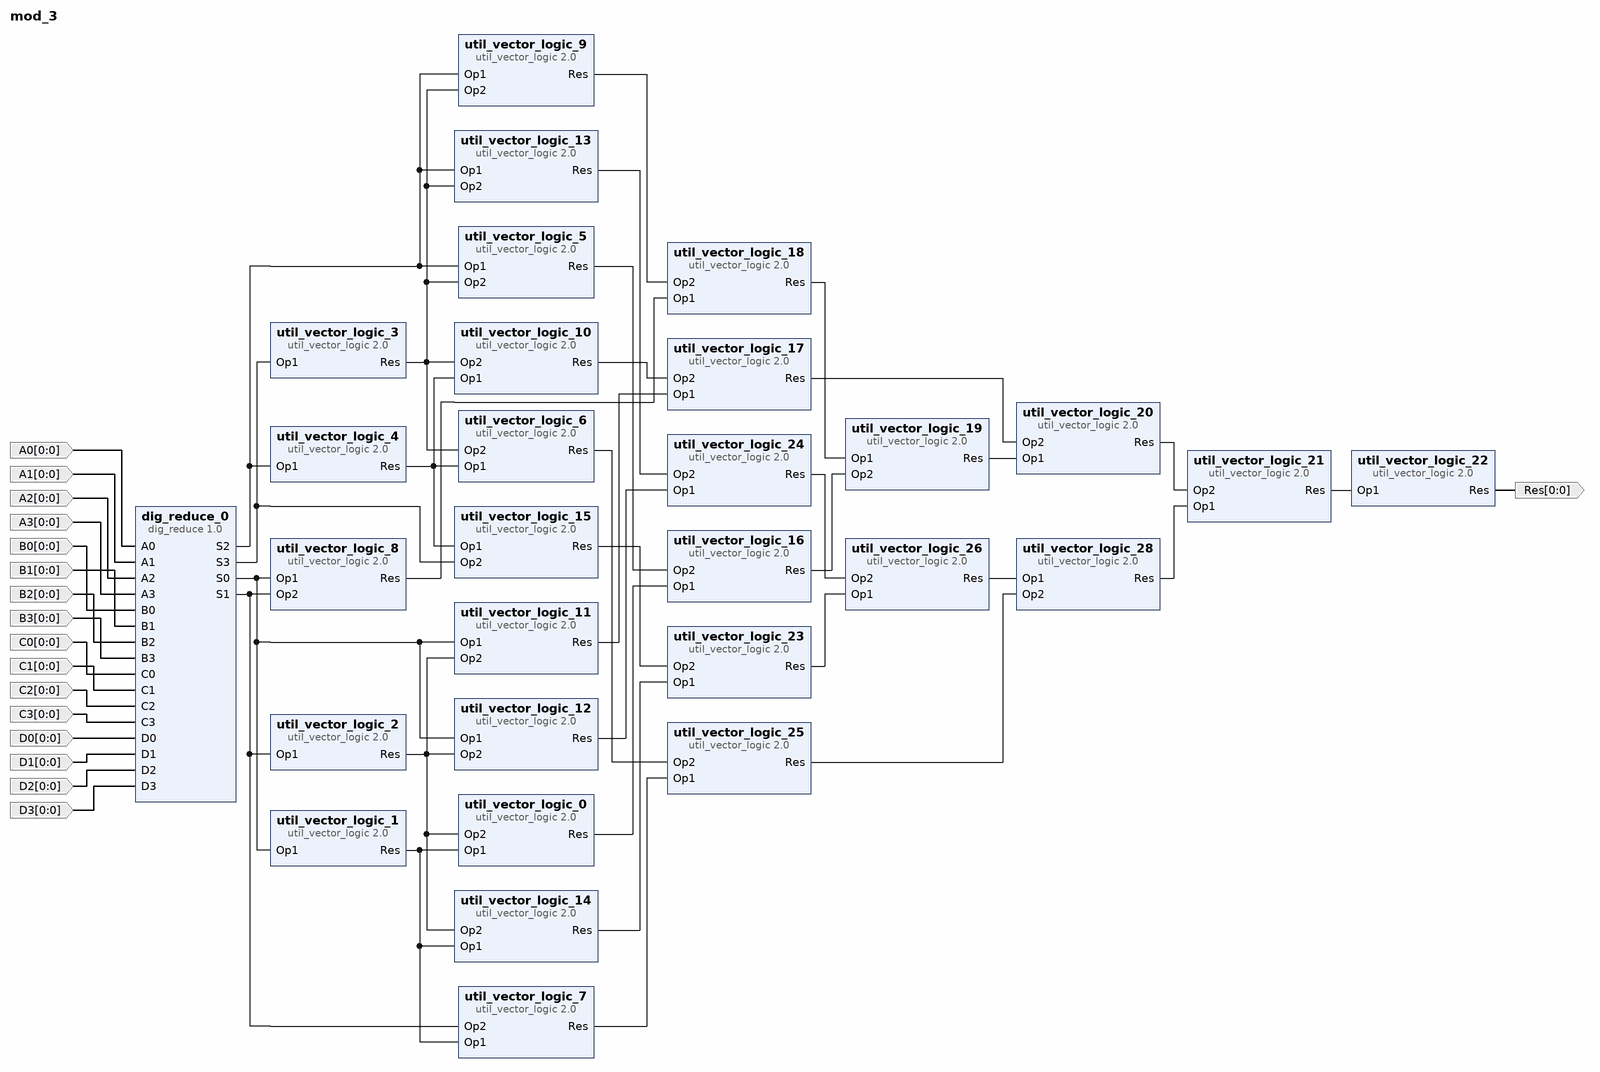
[diagram p0: block diagram of the top level]
# Vivado block design mod_3, xc7vx485tffg1157-1, Vivado 2019.1
create_bd_design mod_3

create_bd_port -dir I -from 0 -to 0 A0
create_bd_port -dir I -from 0 -to 0 A1
create_bd_port -dir I -from 0 -to 0 A2
create_bd_port -dir I -from 0 -to 0 A3
create_bd_port -dir I -from 0 -to 0 B0
create_bd_port -dir I -from 0 -to 0 B1
create_bd_port -dir I -from 0 -to 0 B2
create_bd_port -dir I -from 0 -to 0 B3
create_bd_port -dir I -from 0 -to 0 C0
create_bd_port -dir I -from 0 -to 0 C1
create_bd_port -dir I -from 0 -to 0 C2
create_bd_port -dir I -from 0 -to 0 C3
create_bd_port -dir I -from 0 -to 0 D0
create_bd_port -dir I -from 0 -to 0 D1
create_bd_port -dir I -from 0 -to 0 D2
create_bd_port -dir I -from 0 -to 0 D3
create_bd_port -dir O -from 0 -to 0 Res

create_bd_cell -type ip -vlnv Group5:user:dig_reduce:1.0 dig_reduce_0
create_bd_cell -type ip -vlnv xilinx.com:ip:util_vector_logic:2.0 util_vector_logic_0
set_property -dict {CONFIG.C_SIZE 1} [get_bd_cells util_vector_logic_0]
create_bd_cell -type ip -vlnv xilinx.com:ip:util_vector_logic:2.0 util_vector_logic_1
set_property -dict {CONFIG.C_OPERATION not CONFIG.C_SIZE 1} [get_bd_cells util_vector_logic_1]
create_bd_cell -type ip -vlnv xilinx.com:ip:util_vector_logic:2.0 util_vector_logic_2
set_property -dict {CONFIG.C_OPERATION not CONFIG.C_SIZE 1} [get_bd_cells util_vector_logic_2]
create_bd_cell -type ip -vlnv xilinx.com:ip:util_vector_logic:2.0 util_vector_logic_3
set_property -dict {CONFIG.C_OPERATION not CONFIG.C_SIZE 1} [get_bd_cells util_vector_logic_3]
create_bd_cell -type ip -vlnv xilinx.com:ip:util_vector_logic:2.0 util_vector_logic_4
set_property -dict {CONFIG.C_OPERATION not CONFIG.C_SIZE 1} [get_bd_cells util_vector_logic_4]
create_bd_cell -type ip -vlnv xilinx.com:ip:util_vector_logic:2.0 util_vector_logic_5
set_property -dict {CONFIG.C_SIZE 1} [get_bd_cells util_vector_logic_5]
create_bd_cell -type ip -vlnv xilinx.com:ip:util_vector_logic:2.0 util_vector_logic_6
set_property -dict {CONFIG.C_SIZE 1} [get_bd_cells util_vector_logic_6]
create_bd_cell -type ip -vlnv xilinx.com:ip:util_vector_logic:2.0 util_vector_logic_7
set_property -dict {CONFIG.C_SIZE 1} [get_bd_cells util_vector_logic_7]
create_bd_cell -type ip -vlnv xilinx.com:ip:util_vector_logic:2.0 util_vector_logic_8
set_property -dict {CONFIG.C_SIZE 1} [get_bd_cells util_vector_logic_8]
create_bd_cell -type ip -vlnv xilinx.com:ip:util_vector_logic:2.0 util_vector_logic_9
set_property -dict {CONFIG.C_SIZE 1} [get_bd_cells util_vector_logic_9]
create_bd_cell -type ip -vlnv xilinx.com:ip:util_vector_logic:2.0 util_vector_logic_10
set_property -dict {CONFIG.C_SIZE 1} [get_bd_cells util_vector_logic_10]
create_bd_cell -type ip -vlnv xilinx.com:ip:util_vector_logic:2.0 util_vector_logic_11
set_property -dict {CONFIG.C_SIZE 1} [get_bd_cells util_vector_logic_11]
create_bd_cell -type ip -vlnv xilinx.com:ip:util_vector_logic:2.0 util_vector_logic_12
set_property -dict {CONFIG.C_SIZE 1} [get_bd_cells util_vector_logic_12]
create_bd_cell -type ip -vlnv xilinx.com:ip:util_vector_logic:2.0 util_vector_logic_13
set_property -dict {CONFIG.C_SIZE 1} [get_bd_cells util_vector_logic_13]
create_bd_cell -type ip -vlnv xilinx.com:ip:util_vector_logic:2.0 util_vector_logic_14
set_property -dict {CONFIG.C_SIZE 1} [get_bd_cells util_vector_logic_14]
create_bd_cell -type ip -vlnv xilinx.com:ip:util_vector_logic:2.0 util_vector_logic_15
set_property -dict {CONFIG.C_SIZE 1} [get_bd_cells util_vector_logic_15]
create_bd_cell -type ip -vlnv xilinx.com:ip:util_vector_logic:2.0 util_vector_logic_16
set_property -dict {CONFIG.C_OPERATION or CONFIG.C_SIZE 1} [get_bd_cells util_vector_logic_16]
create_bd_cell -type ip -vlnv xilinx.com:ip:util_vector_logic:2.0 util_vector_logic_17
set_property -dict {CONFIG.C_OPERATION or CONFIG.C_SIZE 1} [get_bd_cells util_vector_logic_17]
create_bd_cell -type ip -vlnv xilinx.com:ip:util_vector_logic:2.0 util_vector_logic_18
set_property -dict {CONFIG.C_OPERATION or CONFIG.C_SIZE 1} [get_bd_cells util_vector_logic_18]
create_bd_cell -type ip -vlnv xilinx.com:ip:util_vector_logic:2.0 util_vector_logic_19
set_property -dict {CONFIG.C_OPERATION or CONFIG.C_SIZE 1} [get_bd_cells util_vector_logic_19]
create_bd_cell -type ip -vlnv xilinx.com:ip:util_vector_logic:2.0 util_vector_logic_20
set_property -dict {CONFIG.C_OPERATION or CONFIG.C_SIZE 1} [get_bd_cells util_vector_logic_20]
create_bd_cell -type ip -vlnv xilinx.com:ip:util_vector_logic:2.0 util_vector_logic_21
set_property -dict {CONFIG.C_OPERATION or CONFIG.C_SIZE 1} [get_bd_cells util_vector_logic_21]
create_bd_cell -type ip -vlnv xilinx.com:ip:util_vector_logic:2.0 util_vector_logic_22
set_property -dict {CONFIG.C_OPERATION not CONFIG.C_SIZE 1} [get_bd_cells util_vector_logic_22]
create_bd_cell -type ip -vlnv xilinx.com:ip:util_vector_logic:2.0 util_vector_logic_23
set_property -dict {CONFIG.C_OPERATION or CONFIG.C_SIZE 1} [get_bd_cells util_vector_logic_23]
create_bd_cell -type ip -vlnv xilinx.com:ip:util_vector_logic:2.0 util_vector_logic_24
set_property -dict {CONFIG.C_OPERATION or CONFIG.C_SIZE 1} [get_bd_cells util_vector_logic_24]
create_bd_cell -type ip -vlnv xilinx.com:ip:util_vector_logic:2.0 util_vector_logic_25
set_property -dict {CONFIG.C_OPERATION or CONFIG.C_SIZE 1} [get_bd_cells util_vector_logic_25]
create_bd_cell -type ip -vlnv xilinx.com:ip:util_vector_logic:2.0 util_vector_logic_26
set_property -dict {CONFIG.C_OPERATION or CONFIG.C_SIZE 1} [get_bd_cells util_vector_logic_26]
create_bd_cell -type ip -vlnv xilinx.com:ip:util_vector_logic:2.0 util_vector_logic_28
set_property -dict {CONFIG.C_OPERATION or CONFIG.C_SIZE 1} [get_bd_cells util_vector_logic_28]

# ---- connections ----

connect_bd_net -net A0_1 [get_bd_ports A0] [get_bd_pins dig_reduce_0/A0]
connect_bd_net -net A1_1 [get_bd_ports A1] [get_bd_pins dig_reduce_0/A1]
connect_bd_net -net A2_1 [get_bd_ports A2] [get_bd_pins dig_reduce_0/A2]
connect_bd_net -net A3_1 [get_bd_ports A3] [get_bd_pins dig_reduce_0/A3]
connect_bd_net -net B0_1 [get_bd_ports B0] [get_bd_pins dig_reduce_0/B0]
connect_bd_net -net B1_1 [get_bd_ports B1] [get_bd_pins dig_reduce_0/B1]
connect_bd_net -net B2_1 [get_bd_ports B2] [get_bd_pins dig_reduce_0/B2]
connect_bd_net -net B3_1 [get_bd_ports B3] [get_bd_pins dig_reduce_0/B3]
connect_bd_net -net C0_1 [get_bd_ports C0] [get_bd_pins dig_reduce_0/C0]
connect_bd_net -net C1_1 [get_bd_ports C1] [get_bd_pins dig_reduce_0/C1]
connect_bd_net -net C2_1 [get_bd_ports C2] [get_bd_pins dig_reduce_0/C2]
connect_bd_net -net C3_1 [get_bd_ports C3] [get_bd_pins dig_reduce_0/C3]
connect_bd_net -net D0_1 [get_bd_ports D0] [get_bd_pins dig_reduce_0/D0]
connect_bd_net -net D1_1 [get_bd_ports D1] [get_bd_pins dig_reduce_0/D1]
connect_bd_net -net D2_1 [get_bd_ports D2] [get_bd_pins dig_reduce_0/D2]
connect_bd_net -net D3_1 [get_bd_ports D3] [get_bd_pins dig_reduce_0/D3]
connect_bd_net [get_bd_pins dig_reduce_0/S3] [get_bd_pins util_vector_logic_3/Op1] [get_bd_pins util_vector_logic_15/Op2]
connect_bd_net [get_bd_pins dig_reduce_0/S2] \
  [get_bd_pins util_vector_logic_4/Op1] [get_bd_pins util_vector_logic_5/Op1] [get_bd_pins util_vector_logic_9/Op1] \
  [get_bd_pins util_vector_logic_13/Op1]
connect_bd_net [get_bd_pins dig_reduce_0/S1] \
  [get_bd_pins util_vector_logic_2/Op1] [get_bd_pins util_vector_logic_8/Op2] [get_bd_pins util_vector_logic_7/Op2]
connect_bd_net [get_bd_pins dig_reduce_0/S0] \
  [get_bd_pins util_vector_logic_1/Op1] [get_bd_pins util_vector_logic_11/Op1] [get_bd_pins util_vector_logic_8/Op1] \
  [get_bd_pins util_vector_logic_12/Op1]
connect_bd_net [get_bd_pins util_vector_logic_3/Res] \
  [get_bd_pins util_vector_logic_10/Op2] [get_bd_pins util_vector_logic_5/Op2] [get_bd_pins util_vector_logic_9/Op2] \
  [get_bd_pins util_vector_logic_6/Op2] [get_bd_pins util_vector_logic_13/Op2]
connect_bd_net [get_bd_pins util_vector_logic_4/Res] \
  [get_bd_pins util_vector_logic_10/Op1] [get_bd_pins util_vector_logic_6/Op1] [get_bd_pins util_vector_logic_15/Op1]
connect_bd_net [get_bd_pins util_vector_logic_2/Res] \
  [get_bd_pins util_vector_logic_11/Op2] [get_bd_pins util_vector_logic_0/Op2] [get_bd_pins util_vector_logic_12/Op2] \
  [get_bd_pins util_vector_logic_14/Op2]
connect_bd_net [get_bd_pins util_vector_logic_1/Res] \
  [get_bd_pins util_vector_logic_0/Op1] [get_bd_pins util_vector_logic_7/Op1] [get_bd_pins util_vector_logic_14/Op1]
connect_bd_net [get_bd_pins util_vector_logic_10/Res] [get_bd_pins util_vector_logic_17/Op2]
connect_bd_net [get_bd_pins util_vector_logic_11/Res] [get_bd_pins util_vector_logic_17/Op1]
connect_bd_net [get_bd_pins util_vector_logic_5/Res] [get_bd_pins util_vector_logic_16/Op2]
connect_bd_net [get_bd_pins util_vector_logic_0/Res] [get_bd_pins util_vector_logic_16/Op1]
connect_bd_net [get_bd_pins util_vector_logic_9/Res] [get_bd_pins util_vector_logic_18/Op2]
connect_bd_net [get_bd_pins util_vector_logic_8/Res] [get_bd_pins util_vector_logic_18/Op1]
connect_bd_net [get_bd_pins util_vector_logic_18/Res] [get_bd_pins util_vector_logic_19/Op1]
connect_bd_net [get_bd_pins util_vector_logic_16/Res] [get_bd_pins util_vector_logic_19/Op2]
connect_bd_net [get_bd_pins util_vector_logic_19/Res] [get_bd_pins util_vector_logic_20/Op1]
connect_bd_net [get_bd_pins util_vector_logic_17/Res] [get_bd_pins util_vector_logic_20/Op2]
connect_bd_net [get_bd_pins util_vector_logic_20/Res] [get_bd_pins util_vector_logic_21/Op2]
connect_bd_net [get_bd_pins util_vector_logic_21/Res] [get_bd_pins util_vector_logic_22/Op1]
connect_bd_net [get_bd_pins util_vector_logic_22/Res] [get_bd_ports Res]
connect_bd_net [get_bd_pins util_vector_logic_14/Res] [get_bd_pins util_vector_logic_23/Op1]
connect_bd_net [get_bd_pins util_vector_logic_15/Res] [get_bd_pins util_vector_logic_23/Op2]
connect_bd_net [get_bd_pins util_vector_logic_12/Res] [get_bd_pins util_vector_logic_24/Op1]
connect_bd_net [get_bd_pins util_vector_logic_13/Res] [get_bd_pins util_vector_logic_24/Op2]
connect_bd_net [get_bd_pins util_vector_logic_7/Res] [get_bd_pins util_vector_logic_25/Op1]
connect_bd_net [get_bd_pins util_vector_logic_6/Res] [get_bd_pins util_vector_logic_25/Op2]
connect_bd_net [get_bd_pins util_vector_logic_23/Res] [get_bd_pins util_vector_logic_26/Op1]
connect_bd_net [get_bd_pins util_vector_logic_24/Res] [get_bd_pins util_vector_logic_26/Op2]
connect_bd_net [get_bd_pins util_vector_logic_25/Res] [get_bd_pins util_vector_logic_28/Op2]
connect_bd_net [get_bd_pins util_vector_logic_26/Res] [get_bd_pins util_vector_logic_28/Op1]
connect_bd_net [get_bd_pins util_vector_logic_28/Res] [get_bd_pins util_vector_logic_21/Op1]

validate_bd_design
save_bd_design
